# EAGLE schematic Orange_Suffocomp (EAGLE 9.6.0)
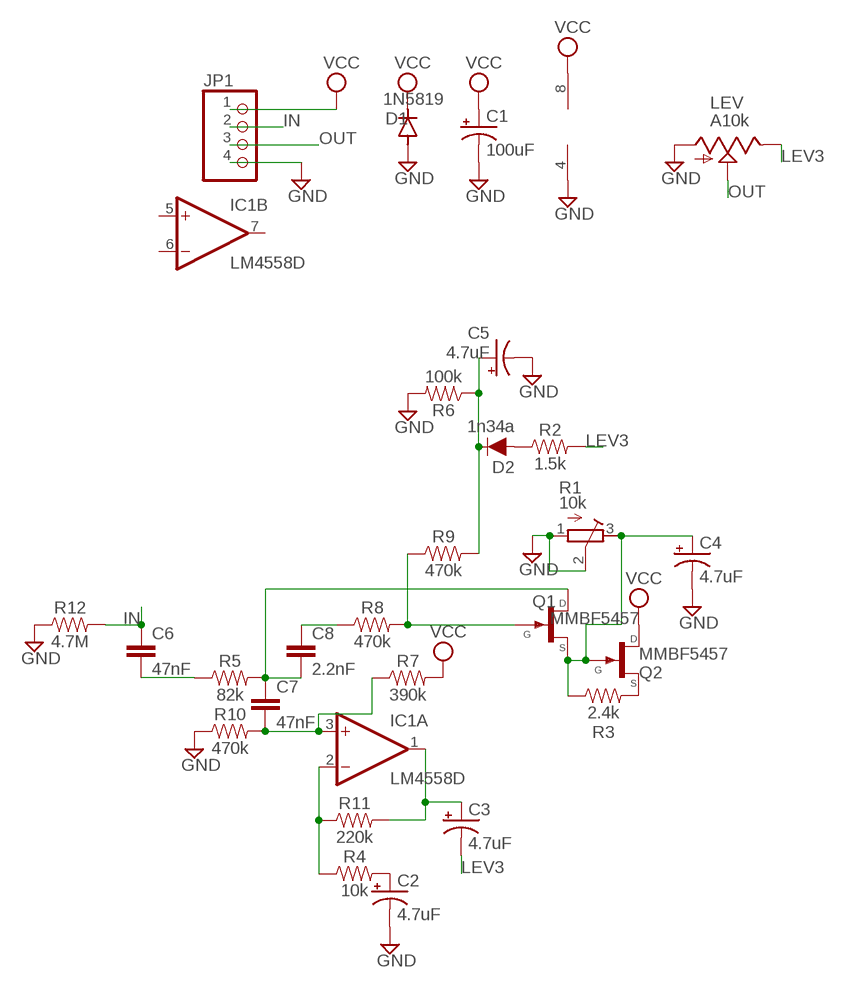
[diagram p0: schematic, sheet 1]

## Parts
C1  100uF  CAP_SMD+THRUPAN_B  [PAN_B_SMD+THRU]
C2  4.7uF  CAP_SMD+THRUPAN_B  [PAN_B_SMD+THRU]
C3  4.7uF  CAP_SMD+THRUPAN_B  [PAN_B_SMD+THRU]
C4  4.7uF  CAP_SMD+THRUPAN_B  [PAN_B_SMD+THRU]
C5  4.7uF  CAP_SMD+THRUPAN_B  [PAN_B_SMD+THRU]
C6  47nF  47NF-0603-25V-5%  [0603]
C7  47nF  47NF-0603-25V-5%  [0603]
C8  2.2nF  2.2NF/2200PF-0603-50V-10%  [0603]
D1  1N5819  DIODE-SOD123  [SOD123]
D2  1n34a  DIODE-1N4148  [DIODE-1N4148]
IC1  LM4558D  [SO08]
JP1  PINHD-1X4  [1X04]
LEV  A10k  9MM_SNAP-IN_POT_  [9MM_SNAP-IN_POT]
Q1  MMBF5457  [SOT23]
Q2  MMBF5457  [SOT23]
R1  10k  R-TRIMM3296W  [RTRIM3296W]
R2  1.5k  1.5KOHM-0603-1/10W-1%  [0603]
R3  2.4k  2.49KOHM-0603-1/10W-1%  [0603]
R4  10k  10KOHM-0603-1/10W-1%  [0603]
R5  82k  82OHM-0603-1/10W-1%  [0603]
R6  100k  100KOHM-0603-1/10W-1%  [0603]
R7  390k  390KOHM-0603-1/10W-1%  [0603]
R8  470k  470OHM-0603-1/10W-1%  [0603]
R9  470k  470OHM-0603-1/10W-1%  [0603]
R10  470k  470OHM-0603-1/10W-1%  [0603]
R11  220k  220KOHM-0603-1/10W-1%  [0603]
R12  4.7M  4.7KOHM-0603-1/10W-1%  [0603]

## Nets
GND: C1.- C1.--(-) C2.- C2.--(-) C4.- C4.--(-) C5.- C5.--(-) D1.A IC1.4(P:V-) JP1.4 LEV.1(A) R1.1(A) R1.2(S) R6.2 R10.1 R12.1
IN: C6.1 JP1.2 R12.2
LEV3: C3.- C3.--(-) LEV.3(E) R2.2
N$1: C6.2 R5.1
N$2: C7.1 C8.2 Q1.1(D) R5.2
N$3: C7.2 IC1.3(A:+IN) R7.1 R10.2
N$4: C8.1 R8.1
N$5: C2.+ C2.++(+) R4.2
N$6: IC1.2(A:-IN) R4.1 R11.1
N$7: C3.+ C3.++(+) IC1.1(A:OUT) R11.2
N$8: Q1.3(G) R8.2 R9.1
N$9: C4.+ C4.++(+) Q1.2(S) Q2.3(G) R1.3(E) R3.1
N$10: Q2.2(S) R3.2
N$11: C5.+ C5.++(+) D2.C R6.1 R9.2
N$12: D2.A R2.1
OUT: JP1.3 LEV.2(S)
VCC: C1.+ C1.++(+) D1.C IC1.8(P:V+) JP1.1 Q2.1(D) R7.2
Unconnected: IC1.5(B:+IN) IC1.6(B:-IN) IC1.7(B:OUT)

## Library data of the parts
C1-C5 = MusicThingModular:CAP_SMD+THRU
C6 C7 = SparkFun-Capacitors:47NF: 47nF ceramic capacitors A capacitor is a passive two-terminal electrical component used to store electrical energy temporarily in an electric field.; PROD_ID: CAP-08605
C8 = SparkFun-Capacitors:2.2NF/2200PF: 2.2nF/2,200pF ceramic capacitors A capacitor is a passive two-terminal electrical component used to store electrical energy temporarily in an electric field.; PROD_ID: CAP-07877
D1 = diode:DIODE-: DIODE
D2 = SparkFun-DiscreteSemi:DIODE: Diode These are standard reverse protection diodes and small signal diodes. SparkFun Products: SparkFun SparkPunk Sound Kit <https://www.sparkfun.com/products/11177> SparkFun ESP8266 Thing <https://www.sparkfun.com/products/13231>; PROD_ID: DIO-08378; VALUE: 200mA/100V/1V
IC1 = linear:*4558: OP AMP
JP1 = Connector:PINHD-1X4: PIN HEADER; CATEGORY: CONNECTOR; SUB-CATEGORY: PIN-HEADER
LEV = MusicThingModular:9MM_SNAP-IN_POT: 9mm vertical snap-in pot, Alpha / Panasonic style
Q1 Q2 = MMBF5457:MMBF5457*: N-Channel JFET; AVAILABILITY: Unavailable; DESCRIPTION: JFET N-Channel 25V 350mW Surface Mount SOT-23-3; MF: ON Semiconductor; MP: MMBF5457; PACKAGE: SOT-23-3 Fairchild Semiconductor; PRICE: None
R1 = resistor:R-TRIMM: Trimm resistor
R2 = SparkFun-Resistors:1.5KOHM: 1.5kΩ resistor A resistor is a passive two-terminal electrical component that implements electrical resistance as a circuit element. Resistors act to reduce current flow, and, at the same time, act to lower voltage levels within circuits. - Wikipedia; PROD_ID: RES-08306
R3 = SparkFun-Resistors:2.49KOHM: 2.49kΩ resistor A resistor is a passive two-terminal electrical component that implements electrical resistance as a circuit element. Resistors act to reduce current flow, and, at the same time, act to lower voltage levels within circuits. - Wikipedia; PROD_ID: RES-09568; VALUE: 2.49k
R4 = SparkFun-Resistors:10KOHM: 10kΩ resistor A resistor is a passive two-terminal electrical component that implements electrical resistance as a circuit element. Resistors act to reduce current flow, and, at the same time, act to lower voltage levels within circuits. - Wikipedia; PROD_ID: RES-00824
R5 = SparkFun-Resistors:82OHM: 82Ω resistor A resistor is a passive two-terminal electrical component that implements electrical resistance as a circuit element. Resistors act to reduce current flow, and, at the same time, act to lower voltage levels within circuits. - Wikipedia; PROD_ID: RES-12311; VALUE: 82
R6 = SparkFun-Resistors:100KOHM: 100kΩ resistor A resistor is a passive two-terminal electrical component that implements electrical resistance as a circuit element. Resistors act to reduce current flow, and, at the same time, act to lower voltage levels within circuits. - Wikipedia; PROD_ID: RES-07828
R7 = SparkFun-Resistors:390KOHM: 390kΩ resistor A resistor is a passive two-terminal electrical component that implements electrical resistance as a circuit element. Resistors act to reduce current flow, and, at the same time, act to lower voltage levels within circuits. - Wikipedia; PROD_ID: RES-12024
R8-R10 = SparkFun-Resistors:470OHM: 470Ω resistor A resistor is a passive two-terminal electrical component that implements electrical resistance as a circuit element. Resistors act to reduce current flow, and, at the same time, act to lower voltage levels within circuits. - Wikipedia; PROD_ID: RES-07869; VALUE: 470
R11 = SparkFun-Resistors:220KOHM: 220kΩ resistor A resistor is a passive two-terminal electrical component that implements electrical resistance as a circuit element. Resistors act to reduce current flow, and, at the same time, act to lower voltage levels within circuits. - Wikipedia; PROD_ID: RES-08969
R12 = SparkFun-Resistors:4.7KOHM: 4.7kΩ resistor A resistor is a passive two-terminal electrical component that implements electrical resistance as a circuit element. Resistors act to reduce current flow, and, at the same time, act to lower voltage levels within circuits. - Wikipedia; PROD_ID: RES-07857; VALUE: 4.7k